# EAGLE schematic 16276 (EAGLE 7.6.0)
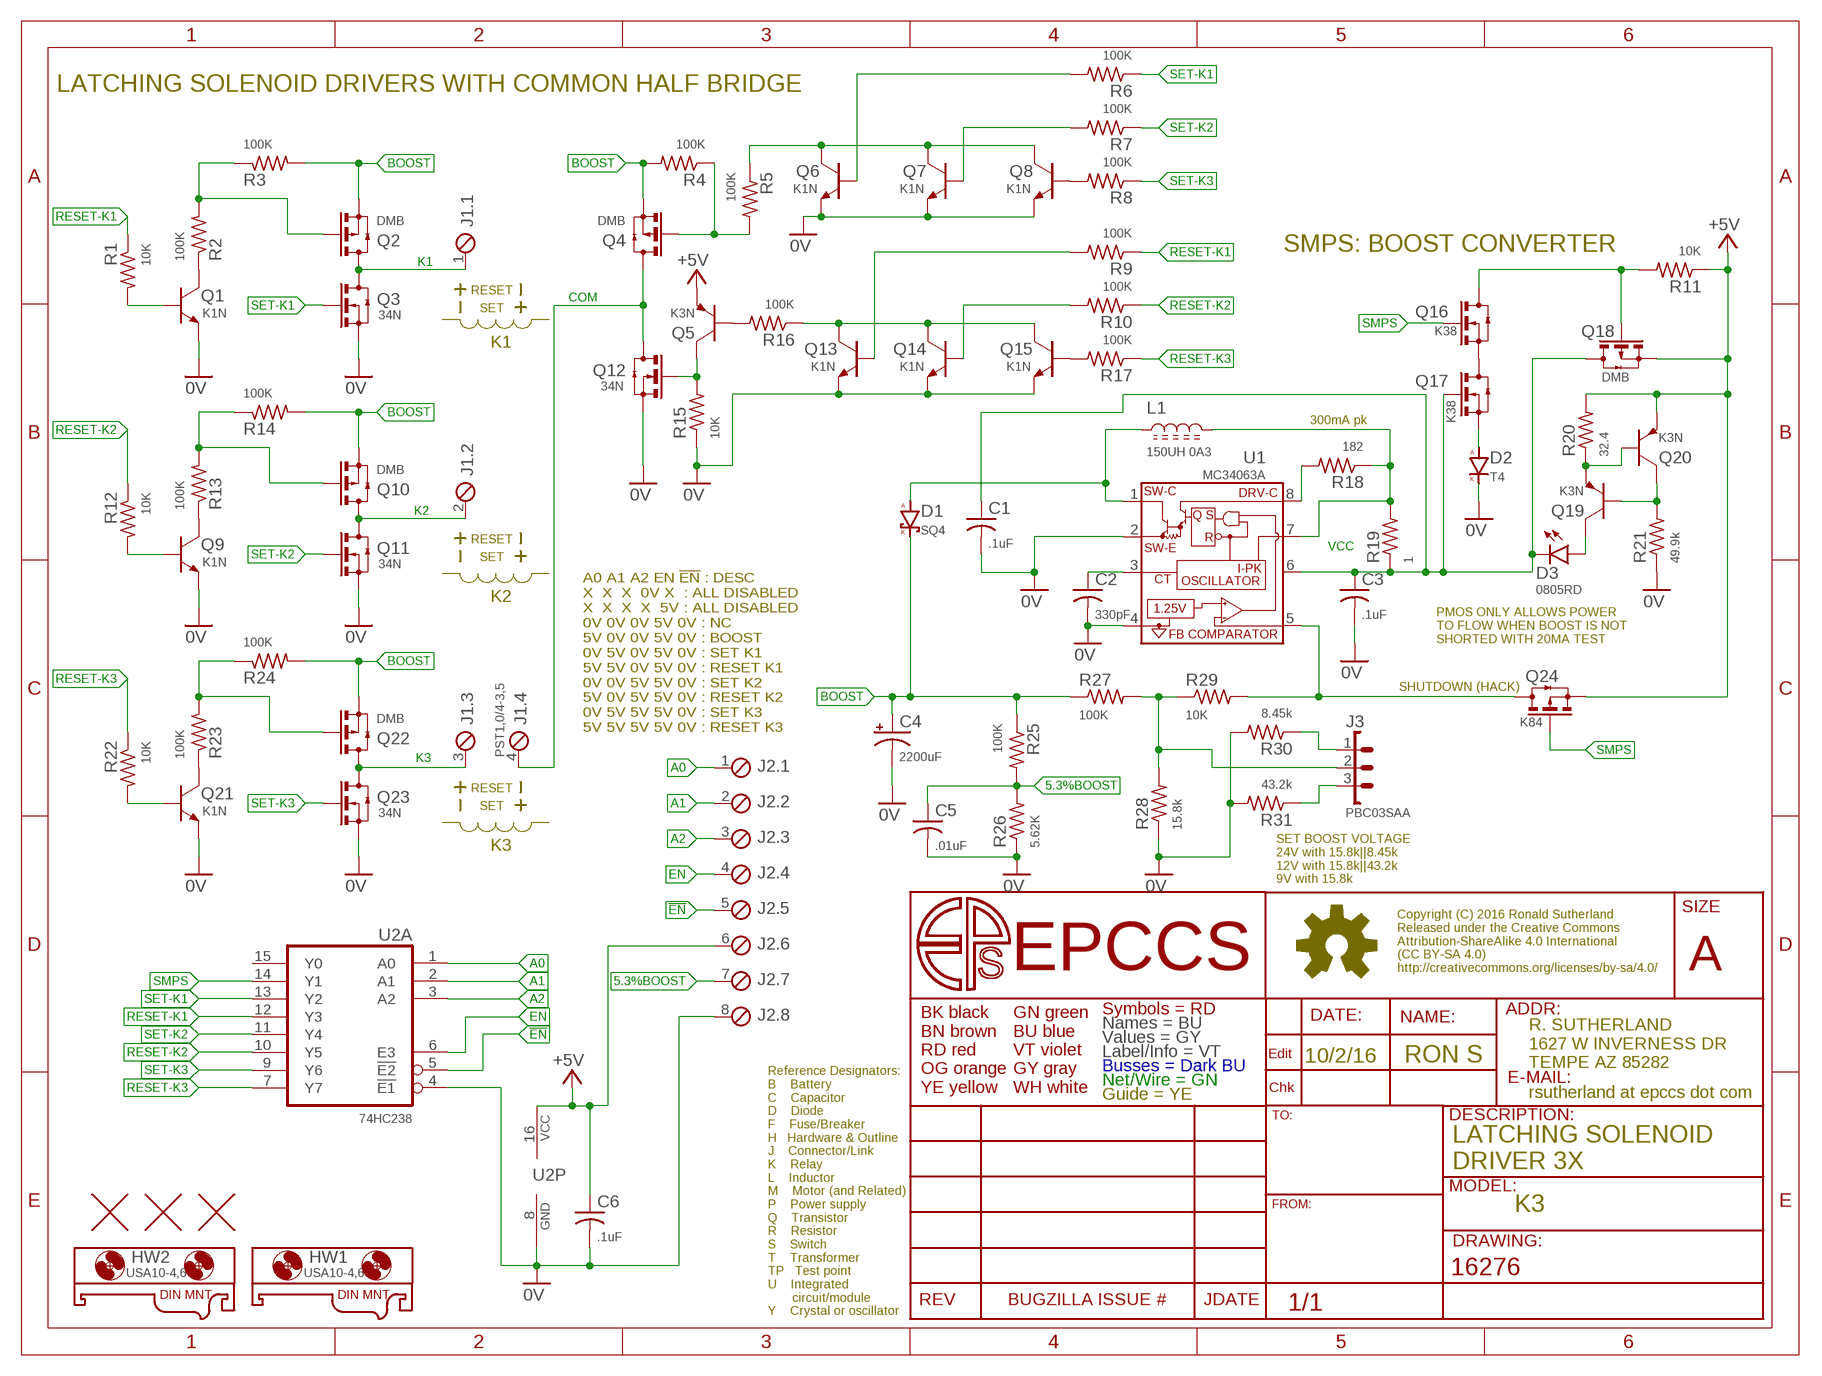
[diagram p0: schematic, sheet 1]

## Parts
C1  .1uF  CC0603A  [C0603(1608)]
C2  330pF  CC0603A  [C0603(1608)]
C3  .1uF  CC0603A  [C0603(1608)]
C4  2200uF  C-AL7.5X18  [E7,5-18]
C5  .01uF  CC0603A  [C0603(1608)]
C6  .1uF  CC0603A  [C0603(1608)]
D1  SQ4  DSMA  [SMA]
D2  T4  DSOD123  [SOD123]
D3  0805RD  LEDC0805(2012)  [C0805(2012)]
HW1  USA10-4,6  MOUNT-HOLE5.0  [USA10]
HW2  USA10-4,6  MOUNT-HOLE5.0  [USA10]
J1  PST1,0/4-3,5  MCV4  [MCV4]
J2  MCV8  [MCV8]
J3  PBC03SAA  1X3  [1X3]
L1  150UH 0A3  L2626  [L2626]
Q1  K1N  NPNSOT23  [SOT23]
Q2  DMB  N-CHSOT23  [SOT23]
Q3  34N  N-CHSOT23  [SOT23]
Q4  DMB  N-CHSOT23  [SOT23]
Q5  K3N  PNPSOT23  [SOT23]
Q6  K1N  NPNSOT23  [SOT23]
Q7  K1N  NPNSOT23  [SOT23]
Q8  K1N  NPNSOT23  [SOT23]
Q9  K1N  NPNSOT23  [SOT23]
Q10  DMB  N-CHSOT23  [SOT23]
Q11  34N  N-CHSOT23  [SOT23]
Q12  34N  N-CHSOT23  [SOT23]
Q13  K1N  NPNSOT23  [SOT23]
Q14  K1N  NPNSOT23  [SOT23]
Q15  K1N  NPNSOT23  [SOT23]
Q16  K38  N-CHSOT23  [SOT23]
Q17  K38  N-CHSOT23  [SOT23]
Q18  DMB  N-CHSOT23  [SOT23]
Q19  K3N  PNPSOT23  [SOT23]
Q20  K3N  PNPSOT23  [SOT23]
Q21  K1N  NPNSOT23  [SOT23]
Q22  DMB  N-CHSOT23  [SOT23]
Q23  34N  N-CHSOT23  [SOT23]
Q24  K84  N-CHSOT23  [SOT23]
R1  10K  R0805  [C0805(2012)]
R2  100K  R0805  [C0805(2012)]
R3  100K  R0805  [C0805(2012)]
R4  100K  R0805  [C0805(2012)]
R5  100K  R0805  [C0805(2012)]
R6  100K  R0805  [C0805(2012)]
R7  100K  R0805  [C0805(2012)]
R8  100K  R0805  [C0805(2012)]
R9  100K  R0805  [C0805(2012)]
R10  100K  R0805  [C0805(2012)]
R11  10K  R0805  [C0805(2012)]
R12  10K  R0805  [C0805(2012)]
R13  100K  R0805  [C0805(2012)]
R14  100K  R0805  [C0805(2012)]
R15  10K  R0805  [C0805(2012)]
R16  100K  R0805  [C0805(2012)]
R17  100K  R0805  [C0805(2012)]
R18  182  R0805  [C0805(2012)]
R19  1  R1210  [C1210(3225)]
R20  32.4  R0805  [C0805(2012)]
R21  49.9k  R0805  [C0805(2012)]
R22  10K  R0805  [C0805(2012)]
R23  100K  R0805  [C0805(2012)]
R24  100K  R0805  [C0805(2012)]
R25  100K  R0805  [C0805(2012)]
R26  5.62K  R0805  [C0805(2012)]
R27  100K  R0805  [C0805(2012)]
R28  15.8k  R0805  [C0805(2012)]
R29  10K  R0805  [C0805(2012)]
R30  8.45k  R0805  [C0805(2012)]
R31  43.2k  R0805  [C0805(2012)]
U1  MC34063A  [SOIC8]
U2  74HC238  74238D  [16SOIC]
U$2  FIDUCIAL1.27  [FIDUCIAL-1.27]
U$3  FIDUCIAL1.27  [FIDUCIAL-1.27]
U$4  FIDUCIAL1.27  [FIDUCIAL-1.27]

## Nets
0V: C1.2 C2.2 C3.2 C4.- C5.2 C6.2 D2.C(K) J2.8 Q1.E Q3.2(S)(S) Q6.E Q7.E Q8.E Q9.E Q11.2(S)(S) Q12.2(S)(S) Q13.E Q14.E Q15.E Q21.E Q23.2(S)(S) R15.1 R21.1 R26.1 R28.1 R30.2 R31.2 U1.2(SW-E) U1.4(GND) U2.4(A:!E1) U2.8(P:GND)
5.3%BOOST: C5.1 J2.7 R25.2 R26.2
!EN: J2.5 U2.5(A:!E2)
+5V: C6.1 J2.6 Q5.E Q18.2(S)(S) Q20.E Q24.2(S)(S) R11.1 R20.2 U2.16(P:VCC)
A0: J2.1 U2.1(A:A0)
A1: J2.2 U2.2(A:A1)
A2: J2.3 U2.3(A:A2)
BOOST: C4.+ D1.K Q2.2(S)(S) Q4.2(S)(S) Q10.2(S)(S) Q22.2(S)(S) R3.2 R4.2 R14.2 R24.2 R25.1 R27.1
COM: J1.4 Q4.3(D)(D) Q12.3(D)(D)
EN: J2.4 U2.6(A:E3)
K1: J1.1 Q2.3(D)(D) Q3.3(D)(D)
K2: J1.2 Q10.3(D)(D) Q11.3(D)(D)
K3: J1.3 Q22.3(D)(D) Q23.3(D)(D)
N$3: Q22.1(G)(G) R23.2 R24.1
N$4: Q21.C R23.1
N$5: Q21.B R22.2
N$6: Q16.2(S)(S) Q17.3(D)(D)
N$7: Q24.3(D)(D) R29.2 U1.5(FB)
N$8: D2.A Q17.2(S)(S)
N$9: Q4.1(G)(G) R4.1 R5.2
N$13: R18.2 U1.8(DRV-C)
N$14: L1.2 R18.1 R19.2 U1.7(I-PK)
N$15: D1.A L1.1 U1.1(SW-C)
N$16: C2.1 U1.3(CT)
N$21: Q5.C Q12.1(G)(G) R15.2
N$22: Q16.3(D)(D) Q18.1(G)(G) R11.2
N$26: J3.2 R27.2 R28.2 R29.1
N$27: Q6.C Q7.C Q8.C R5.1
N$28: Q6.B R6.2
N$33: Q8.B R8.2
N$35: Q2.1(G)(G) R2.2 R3.1
N$36: Q1.C R2.1
N$37: Q1.B R1.2
N$43: Q10.1(G)(G) R13.2 R14.1
N$44: Q9.C R13.1
N$45: Q9.B R12.2
N$71: Q7.B R7.2
N$72: Q5.B R16.2
N$73: Q13.C Q14.C Q15.C R16.1
N$79: Q13.B R9.2
N$81: Q14.B R10.2
N$86: D3.A Q19.C
N$87: Q15.B R17.2
N$120: J3.3 R31.1
N$121: J3.1 R30.1
N$128: Q19.E Q20.B R20.1
N$132: Q19.B Q20.C R21.2
RESET-K1: R1.1 R9.1 U2.12(A:Y3)
RESET-K2: R10.1 R12.1 U2.10(A:Y5)
RESET-K3: R17.1 R22.1 U2.7(A:Y7)
SET-K1: Q3.1(G)(G) R6.1 U2.13(A:Y2)
SET-K2: Q11.1(G)(G) R7.1 U2.11(A:Y4)
SET-K3: Q23.1(G)(G) R8.1 U2.9(A:Y6)
SMPS: Q16.1(G)(G) Q24.1(G)(G) U2.14(A:Y1)
VCC: C1.1 C3.1 D3.K Q17.1(G)(G) Q18.3(D)(D) R19.1 U1.6(VCC)
Unconnected: U2.15(A:Y0)

## Notes on the sheet
- LATCHING SOLENOID DRIVERS WITH COMMON HALF BRIDGE
- SMPS: BOOST CONVERTER
- RESET
- SET
- K1
- 300mA pk
- RESET
- SET
- K2
- PMOS ONLY ALLOWS POWER 
  TO FLOW WHEN BOOST IS NOT
  SHORTED WITH 20MA TEST
- SHUTDOWN (HACK)
- A0 A1 A2 EN !EN! : DESC
  X  X  X  0V X  : ALL DISABLED
  X  X  X  X  5V : ALL DISABLED
  0V 0V 0V 5V 0V : NC
  5V 0V 0V 5V 0V : BOOST
  0V 5V 0V 5V 0V : SET K1
  5V 5V 0V 5V 0V : RESET K1
  0V 0V 5V 5V 0V : SET K2
  5V 0V 5V 5V 0V : RESET K2
  0V 5V 5V 5V 0V : SET K3
  5V 5V 5V 5V 0V : RESET K3
- RESET
- SET
- K3
- SET BOOST VOLTAGE
  24V with 15.8k||8.45k
  12V with 15.8k||43.2k
  9V with 15.8k
- 10/2/16 | RON S
- LATCHING SOLENOID
  DRIVER 3X
- K3

## Library data of the parts
C1-C3 C5 C6 = C-C:C: CAPACITOR Symbol
C4 = C-Al:C-AL: Aluminum Electrolytic Capacitors PW1J222 [NICHICON,UPW1J222MHD] CAP ALUM 63V 2200UF 20% RADIAL
D1 = D-SBR:D: DIODE
D2 = D-GP:D: DIODE
D3 = D-LED:LED: LED 120120WH [CREE,XHGAWT-00-0000-00000HXE1] LED WHITE 6500K 150LUM-W120120
HW1 HW2 = HW-DINMnt:MOUNT-HOLE: USA10-4.6 [PhxCont,1202713] DINRAIL ADAPTER UNIVERSAL 10MM 4.6MM
J1 = J-HDR3.5mm:MCV4: MCV 1,5/4-G-3,5-RN [PHOENIX CONTACT,1843622] CONN HEADER SHROUDED 2POS 3.5MM PST 1,0/4-3,5 [PHOENIX CONTACT,1945119] CONN HEADER STRIP PIN 4POS 3.5MM MCVR 1,5& 4-ST-3,5 [PHOENIX CONTACT,1863178] CONN PLUG 4POS SCREW 3.5MM
J2 = J-HDR3.5mm:MCV8: MC1,5&8-G-3,5 [PHOENIX CONTACT,1844278] CONN HEADER SHROUDED 8POS 3.5MM MCV1,5&8-G-3,5 [PHOENIX CONTACT,1843664] CONN HEADER SHROUDED 8POS 3.5MM MCVR1,5&8-ST-3,5 [PHOENIX CONTACT,1863217] CONN PLUG 8POS SCREW 3.5MM
J3 = J-HDR2.54mm:1X3: 6 POS HEADER PBC03SAAN [SULLINS,PBC03SAAN]HEADER MALE BRKWAY 3POS .1IN AA
L1 = L-PWR:L: Inductor
Q1 Q6-Q9 Q13-Q15 Q21 = Q-NPN:NPN: BJT NPN General Purpose Amplifier
Q2 Q4 Q10 Q18 Q22 Q24 = Q-PCH:N-CH?*: ENHANCEMENT MODE MOSFET SOT23 is BSS138 pinout
Q3 Q11 Q12 Q16 Q17 Q23 = Q-NCH:N-CH?*: ENHANCEMENT MODE MOSFET SOT23 is BSS138 pinout
Q5 Q19 Q20 = Q-PNP:PNP: BJT NPN General Purpose Amplifier
R1-R31 = R-C:R: Resiistor American-style symbol
U1 = U-Boost:MC34063A
U2 = U-7400:74*238: non-Inverting Logic 3- to 8-Line Decoder/Demultiplexer see 74138 for Inverting
U$2-U$4 = H-Fiducial:FIDUCIAL: Fiducial Alignment Points Various fiducial points for machine vision alignment.

## Net classes
0 default: width 0.254 mm, drill 0.33 mm